# EAGLE design diodes (EAGLE 8.7.1)
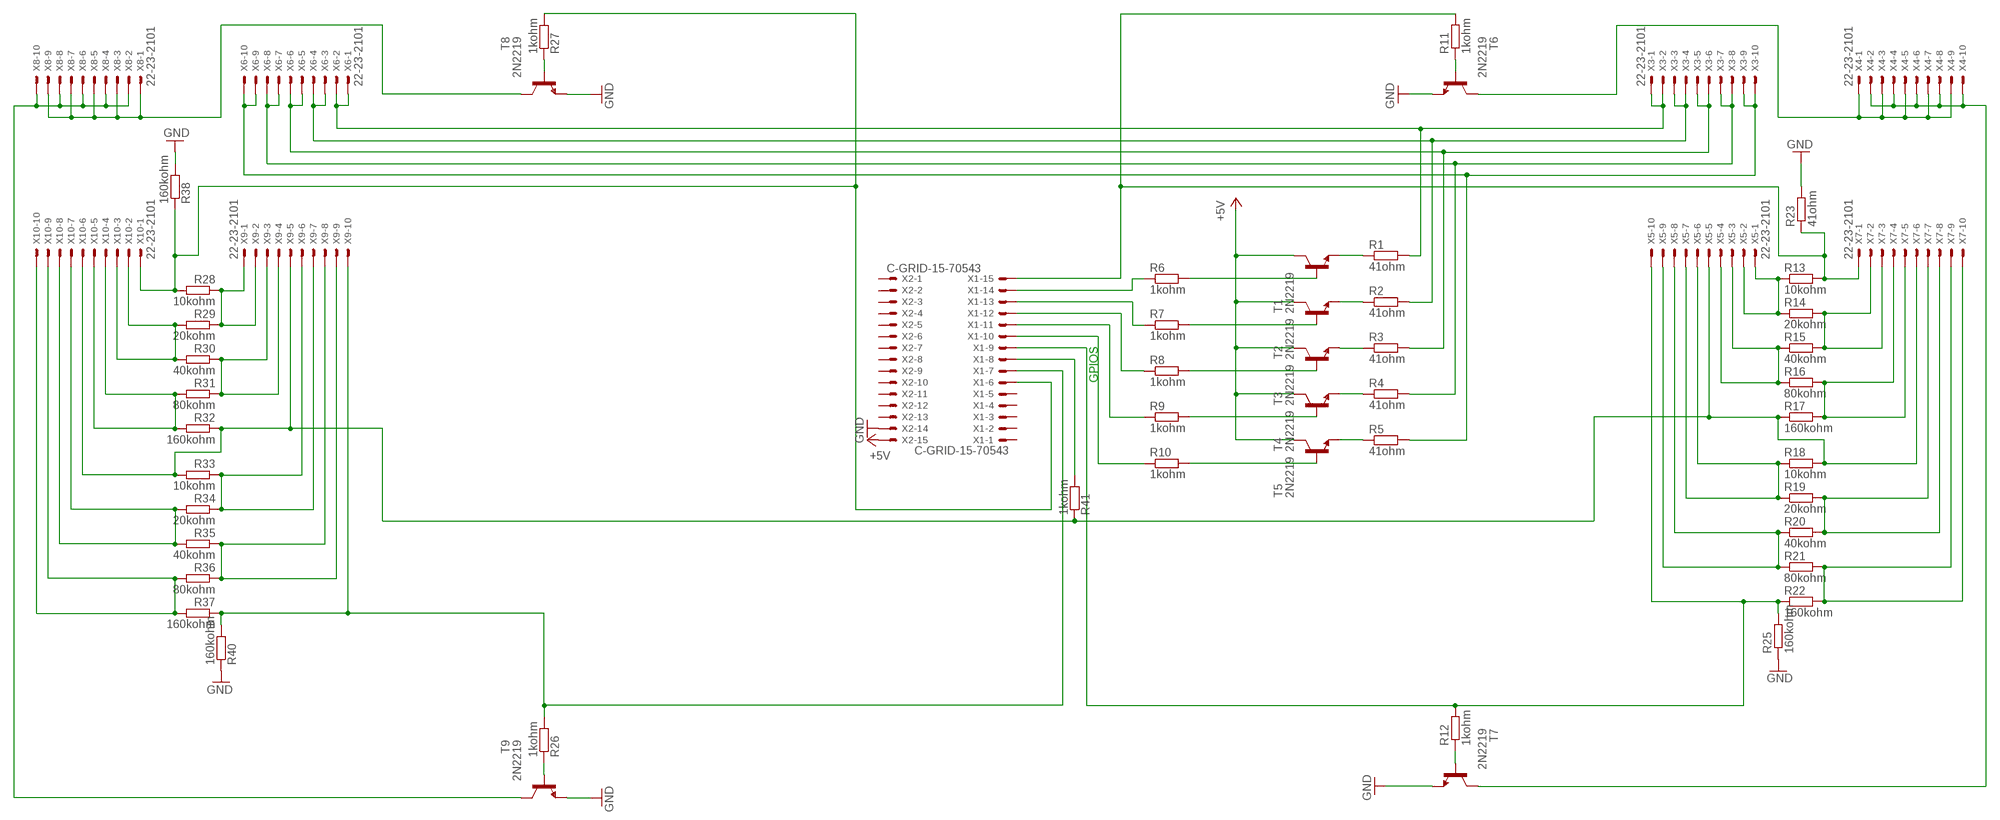
[diagram p0: schematic, sheet 1]

## Parts
R1  41ohm  R-EU_0207/10  [0207/10]
R2  41ohm  R-EU_0207/10  [0207/10]
R3  41ohm  R-EU_0207/10  [0207/10]
R4  41ohm  R-EU_0207/10  [0207/10]
R5  41ohm  R-EU_0207/10  [0207/10]
R6  1kohm  R-EU_0207/10  [0207/10]
R7  1kohm  R-EU_0207/10  [0207/10]
R8  1kohm  R-EU_0207/10  [0207/10]
R9  1kohm  R-EU_0207/10  [0207/10]
R10  1kohm  R-EU_0207/10  [0207/10]
R11  1kohm  R-EU_0207/10  [0207/10]
R12  1kohm  R-EU_0207/10  [0207/10]
R13  10kohm  R-EU_0207/10  [0207/10]
R14  20kohm  R-EU_0207/10  [0207/10]
R15  40kohm  R-EU_0207/10  [0207/10]
R16  80kohm  R-EU_0207/10  [0207/10]
R17  160kohm  R-EU_0207/10  [0207/10]
R18  10kohm  R-EU_0207/10  [0207/10]
R19  20kohm  R-EU_0207/10  [0207/10]
R20  40kohm  R-EU_0207/10  [0207/10]
R21  80kohm  R-EU_0207/10  [0207/10]
R22  160kohm  R-EU_0207/10  [0207/10]
R23  41ohm  R-EU_0207/10  [0207/10]
R25  160kohm  R-EU_0207/10  [0207/10]
R26  1kohm  R-EU_0207/10  [0207/10]
R27  1kohm  R-EU_0207/10  [0207/10]
R28  10kohm  R-EU_0207/10  [0207/10]
R29  20kohm  R-EU_0207/10  [0207/10]
R30  40kohm  R-EU_0207/10  [0207/10]
R31  80kohm  R-EU_0207/10  [0207/10]
R32  160kohm  R-EU_0207/10  [0207/10]
R33  10kohm  R-EU_0207/10  [0207/10]
R34  20kohm  R-EU_0207/10  [0207/10]
R35  40kohm  R-EU_0207/10  [0207/10]
R36  80kohm  R-EU_0207/10  [0207/10]
R37  160kohm  R-EU_0207/10  [0207/10]
R38  160kohm  R-EU_0207/10  [0207/10]
R40  160kohm  R-EU_0207/10  [0207/10]
R41  1kohm  R-EU_0207/10  [0207/10]
T1  2N2219  [TO5]
T2  2N2219  [TO5]
T3  2N2219  [TO5]
T4  2N2219  [TO5]
T5  2N2219  [TO5]
T6  2N2219  [TO5]
T7  2N2219  [TO5]
T8  2N2219  [TO5]
T9  2N2219  [TO5]
X1  C-GRID-15-70543  [70543-15]
X2  C-GRID-15-70543  [70543-15]
X3  22-23-2101  [22-23-2101]
X4  22-23-2101  [22-23-2101]
X5  22-23-2101  [22-23-2101]
X6  22-23-2101  [22-23-2101]
X7  22-23-2101  [22-23-2101]
X8  22-23-2101  [22-23-2101]
X9  22-23-2101  [22-23-2101]
X10  22-23-2101  [22-23-2101]

## Nets
+5V: T1.3(C) T2.3(C) T3.3(C) T4.3(C) T5.3(C) X2.15
GND: R23.2 R25.1 R38.2 R40.1 T6.1(E) T7.1(E) T8.1(E) T9.1(E) X2.14
N$1: R6.2 T1.2(B)
N$2: R27.2 R28.2 R38.1 X1.6 X10.1
N$4: T6.3(C) X4.1 X4.3 X4.5 X4.7 X4.9
N$5: R13.1 R14.1 X5.1 X5.2
N$6: R41.2 X1.8
N$7: R15.1 R16.1 X5.3 X5.4
N$8: R3.1 T3.1(E)
N$9: R4.1 T4.1(E)
N$10: R5.1 T5.1(E)
N$11: R2.1 T2.1(E)
N$12: R1.1 T1.1(E)
N$13: R6.1 X1.14
N$14: R7.1 X1.13
N$15: R8.1 X1.12
N$16: R9.1 X1.11
N$17: R10.1 X1.10
N$18: R10.2 T5.2(B)
N$19: R9.2 T4.2(B)
N$20: R8.2 T3.2(B)
N$21: R7.2 T2.2(B)
N$22: R14.2 R15.2 X7.2 X7.3
N$23: R12.1 T7.2(B)
N$24: R11.1 T6.2(B)
N$25: R17.1 R18.2 R32.1 R33.2 R41.1 X5.5 X7.6 X9.5 X10.6
N$27: R19.2 R20.2 X7.7 X7.8
N$29: R21.2 R22.2 X7.9 X7.10
N$30: R26.1 T9.2(B)
N$31: R27.1 T8.2(B)
N$33: T9.3(C) X8.2 X8.4 X8.6 X8.8 X8.10
N$34: R16.2 R17.2 X7.4 X7.5
N$35: R33.1 R34.1 X9.6 X9.7
N$38: R18.1 R19.1 X5.6 X5.7
N$39: R2.2 X3.3 X3.4 X6.3 X6.4
N$40: R1.2 X3.1 X3.2 X6.1 X6.2
N$41: T7.3(C) X4.2 X4.4 X4.6 X4.8 X4.10
N$43: R20.1 R21.1 X5.8 X5.9
N$44: R11.2 R13.2 R23.1 X1.15 X7.1
N$46: R3.2 X3.5 X3.6 X6.5 X6.6
N$47: R4.2 X3.7 X3.8 X6.7 X6.8
N$49: R5.2 X3.9 X3.10 X6.9 X6.10
N$52: R12.2 R22.1 R25.2 X1.9 X5.10
N$54: T8.3(C) X8.1 X8.3 X8.5 X8.7 X8.9
N$55: R28.1 R29.1 X9.1 X9.2
N$56: R30.1 R31.1 X9.3 X9.4
N$59: R34.2 R35.2 X10.7 X10.8
N$61: R35.1 R36.1 X9.8 X9.9
N$62: R29.2 R30.2 X10.2 X10.3
N$63: R31.2 R32.2 X10.4 X10.5
N$64: R26.2 R37.1 R40.2 X1.7 X9.10
N$65: R36.2 R37.2 X10.9 X10.10
Unconnected: X1.1 X1.2 X1.3 X1.4 X1.5 X2.1 X2.2 X2.3 X2.4 X2.5 X2.6 X2.7 X2.8 X2.9 X2.10 X2.11 X2.12 X2.13

## Notes on the sheet
- GPIOS

## Library data of the parts
R1-R23 R25-R38 R40 R41 = rcl:R-EU_: RESISTOR, European symbol; SPICEPREFIX: R
T1-T9 = transistor:2N2219: NPN TRANSISTOR
X1 X2 = con-molex:C-GRID-15: CONNECTOR wire to board 2.54 mm (0.100") pitch header; MF: MOLEX; OC_FARNELL: unknown; OC_NEWARK: unknown
X3-X10 = con-molex:22-23-2101: .100" (2.54mm) Center Header - 10 Pin; MF: MOLEX; MPN: 22-23-2101; OC_FARNELL: 1756828; OC_NEWARK: 94C0765

## Board
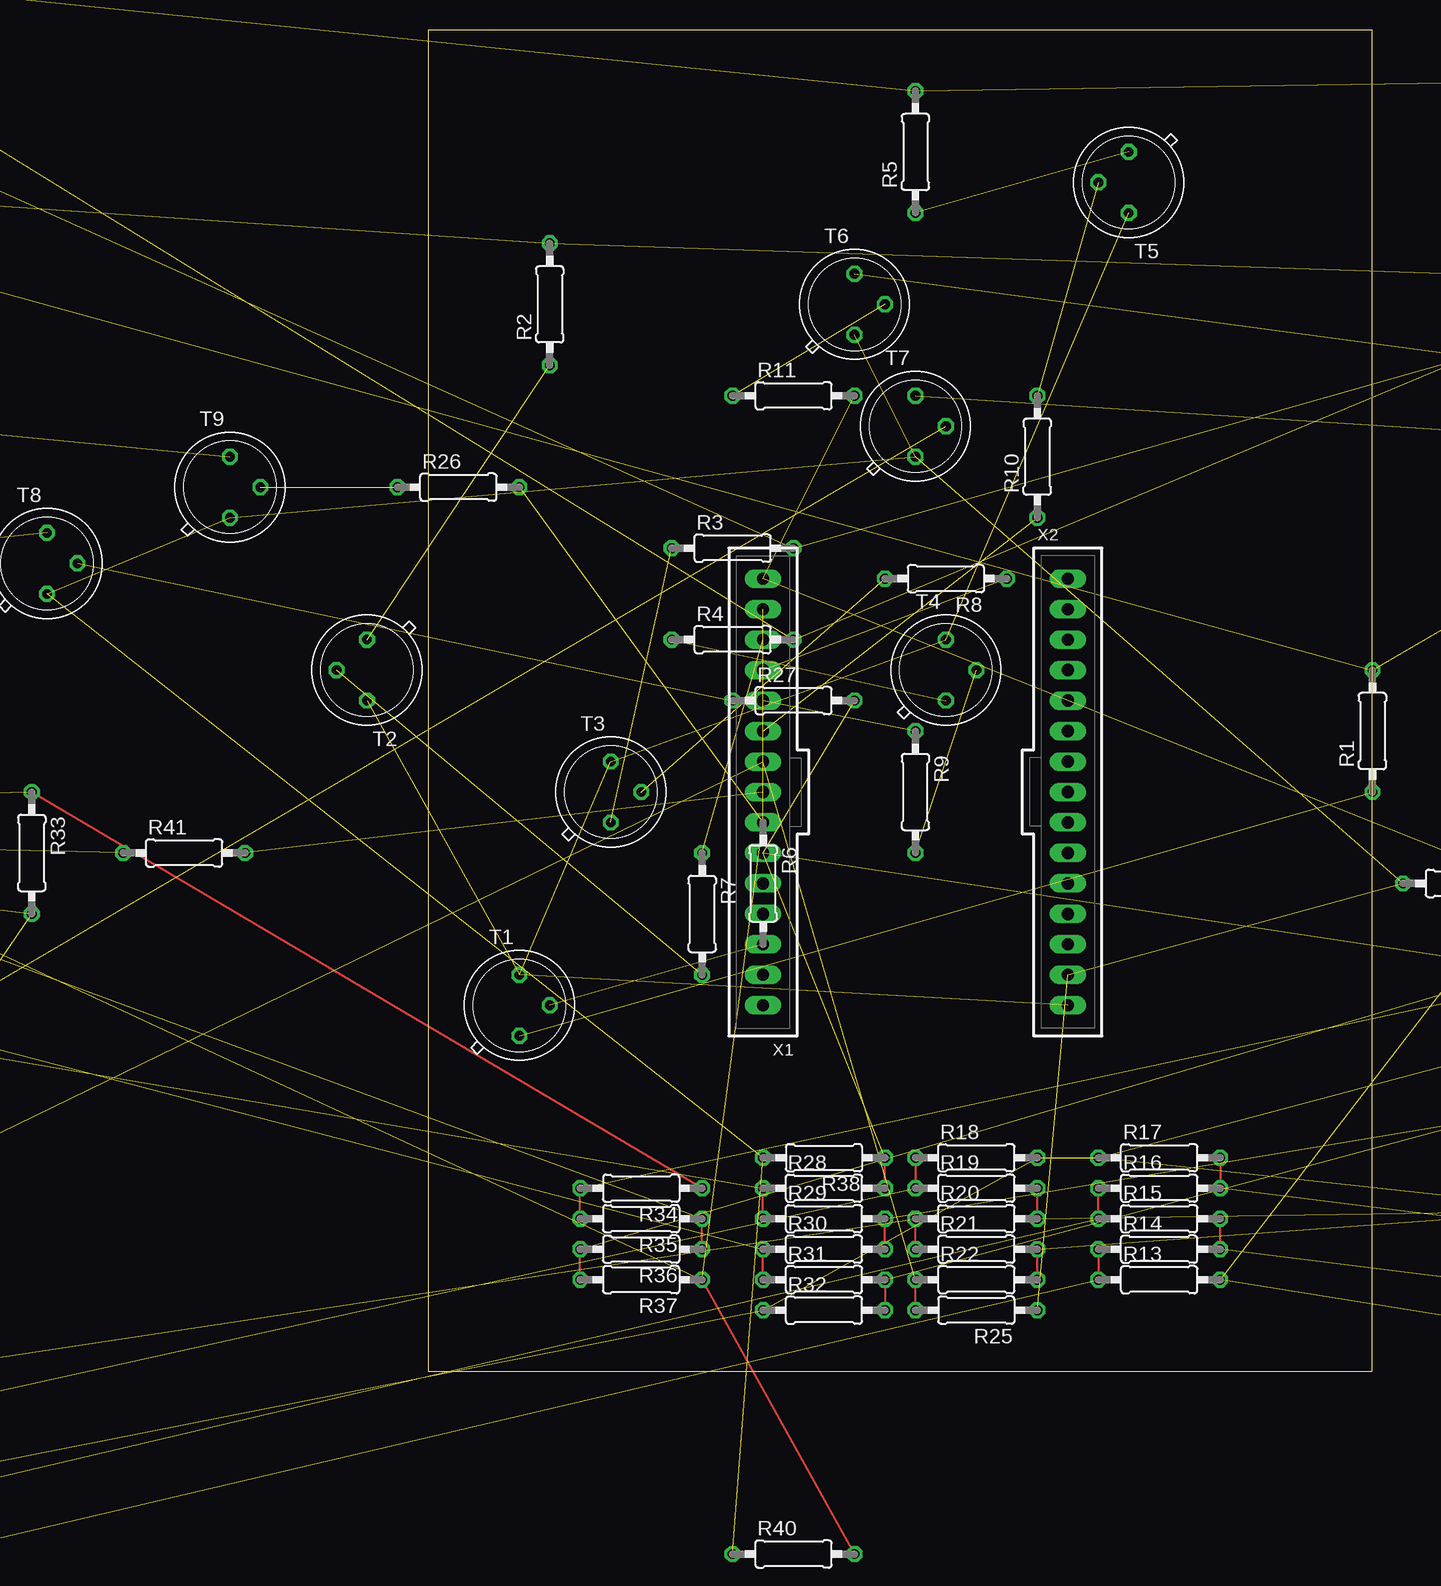
[diagram p1: board, top side]

Size 78.74 x 111.76 mm. Coordinates in mm from the lower left corner, seen from the top.
Outline: 0,0 78.74,0 78.74,111.76 0,111.76 0,0
Copper layers (1*16): Top 0.035mm / dielectric 1.5mm / Bottom 0.035mm
Design rules "default": minimum track width 6mil, minimum drill 0.35mm, track to track 6mil, track to pad 6mil, pad to pad 6mil, via to via 6mil, smd to smd 6mil, copper to edge 40mil, drill to drill 6mil, minimum pad ring 10mil, minimum via ring 8mil, stop-mask expansion 4mil, vias tented up to drill 0mil, thermal gap 10mil

### Footprints (pad centres in the part's own frame; a part is rotated, then mirrored left to right if it is on the bottom)
0207/10 = drill 0.813 octagon: 1 -5.08,0; 2 5.08,0
TO5 = drill 0.813 octagon: 1 0,-2.54; 2 2.54,0; 3 0,2.54
70543-15 = drill 1.016 long: 1 -17.78,0; 2 -15.24,0; 3 -12.7,0; 4 -10.16,0; 5 -7.62,0; 6 -5.08,0; 7 -2.54,0; 8 0,0; 9 2.54,0; 10 5.08,0; 11 7.62,0; 12 10.16,0; 13 12.7,0; 14 15.24,0; 15 17.78,0
22-23-2101 = drill 1 long: 1 -11.43,0; 2 -8.89,0; 3 -6.35,0; 4 -3.81,0; 5 -1.27,0; 6 1.27,0; 7 3.81,0; 8 6.35,0; 9 8.89,0; 10 11.43,0

### Placement (x,y rotation side)
R1  78.74,53.34 90 top
R2  10.16,88.9 90 top
R3  25.4,68.58 0 top
R4  25.4,60.96 0 top
R5  40.64,101.6 90 top
R6  27.94,40.64 270 top
R7  22.86,38.1 270 top
R8  43.18,66.04 180 top
R9  40.64,48.26 270 top
R10  50.8,76.2 90 top
R11  30.48,81.28 0 top
R12  -60.96,12.7 270 top  (outside the outline)
R13  60.96,7.62 0 top
R14  60.96,10.16 0 top
R15  60.96,12.7 0 top
R16  60.96,15.24 0 top
R17  60.96,17.78 0 top
R18  45.72,17.78 0 top
R19  45.72,15.24 0 top
R20  45.72,12.7 0 top
R21  45.72,10.16 0 top
R22  45.72,7.62 0 top
R23  86.36,40.64 180 top
R25  45.72,5.08 180 top
R26  2.54,73.66 0 top
R27  30.48,55.88 0 top
R28  33.02,15.24 0 top
R29  33.02,12.7 0 top
R30  33.02,10.16 0 top
R31  33.02,7.62 0 top
R32  33.02,5.08 0 top
R33  -33.02,43.18 270 top  (outside the outline)
R34  17.78,15.24 180 top
R35  17.78,12.7 180 top
R36  17.78,10.16 180 top
R37  17.78,7.62 180 top
R38  33.02,17.78 180 top
R40  30.48,-15.24 0 top  (outside the outline)
R41  -20.32,43.18 0 top  (outside the outline)
T1  7.62,30.48 0 top
T2  -5.08,58.42 180 top  (outside the outline)
T3  15.24,48.26 0 top
T4  43.18,58.42 0 top
T5  58.42,99.06 180 top
T6  35.56,88.9 0 top
T7  40.64,78.74 0 top
T8  -31.75,67.31 0 top  (outside the outline)
T9  -16.51,73.66 0 top  (outside the outline)
X1  27.94,48.26 90 top
X2  53.34,48.26 270 top
X3  124.46,96.52 90 top  (outside the outline)
X4  139.7,68.58 90 top  (outside the outline)
X5  -68.58,-12.7 90 top  (outside the outline)
X6  -45.72,104.14 90 top  (outside the outline)
X7  137.16,7.62 90 top  (outside the outline)
X8  -55.88,73.66 90 top  (outside the outline)
X9  -83.82,45.72 90 top  (outside the outline)
X10  137.16,38.1 90 top  (outside the outline)

### Tracks (layer width: path | path; a pad name or v marks a point on that pad's centre or on a via)
+5V  (5 unrouted)
GND  (8 unrouted)
N$1  (1 unrouted)
N$2  (3 unrouted)
  Top 0.152: R28.2 R38.1
N$4  (5 unrouted)
N$5  (2 unrouted)
  Top 0.152: R14.1 R13.1
N$6  (1 unrouted)
N$7  (2 unrouted)
  Top 0.152: R15.1 R16.1
N$8  (1 unrouted)
N$9  (1 unrouted)
N$10  (1 unrouted)
N$11  (1 unrouted)
N$12  (1 unrouted)
N$13  (1 unrouted)
N$14  (1 unrouted)
N$15  (1 unrouted)
N$16  (1 unrouted)
N$17  (1 unrouted)
N$18  (1 unrouted)
N$19  (1 unrouted)
N$20  (1 unrouted)
N$21  (1 unrouted)
N$22  (2 unrouted)
  Top 0.152: R14.2 R15.2
N$23  (1 unrouted)
N$24  (1 unrouted)
N$25  (8 unrouted)
N$27  (2 unrouted)
  Top 0.152: R20.2 R19.2
N$29  (2 unrouted)
  Top 0.152: R22.2 R21.2
N$30  (1 unrouted)
N$31  (1 unrouted)
N$33  (5 unrouted)
N$34  (2 unrouted)
  Top 0.152: R17.2 R16.2
N$35  (2 unrouted)
  Top 0.152: R34.1 R33.1
N$38  (2 unrouted)
  Top 0.152: R18.1 R19.1
N$39  (4 unrouted)
N$40  (4 unrouted)
N$41  (5 unrouted)
N$43  (2 unrouted)
  Top 0.152: R21.1 R20.1
N$44  (4 unrouted)
N$46  (4 unrouted)
N$47  (4 unrouted)
N$49  (4 unrouted)
N$52  (3 unrouted)
  Top 0.152: R25.2 R22.1
N$54  (5 unrouted)
N$55  (2 unrouted)
  Top 0.152: R29.1 R28.1
N$56  (2 unrouted)
  Top 0.152: R31.1 R30.1
N$59  (2 unrouted)
  Top 0.152: R35.2 R34.2
N$61  (2 unrouted)
  Top 0.152: R36.1 R35.1
N$62  (2 unrouted)
  Top 0.152: R30.2 R29.2
N$63  (2 unrouted)
  Top 0.152: R31.2 R32.2
N$64  (3 unrouted)
  Top 0.152: R37.1 R40.2
N$65  (2 unrouted)
  Top 0.152: R37.2 R36.2